# Altium schematic sheet USB_Hub.SchDoc (part 1 of 3)
size A3
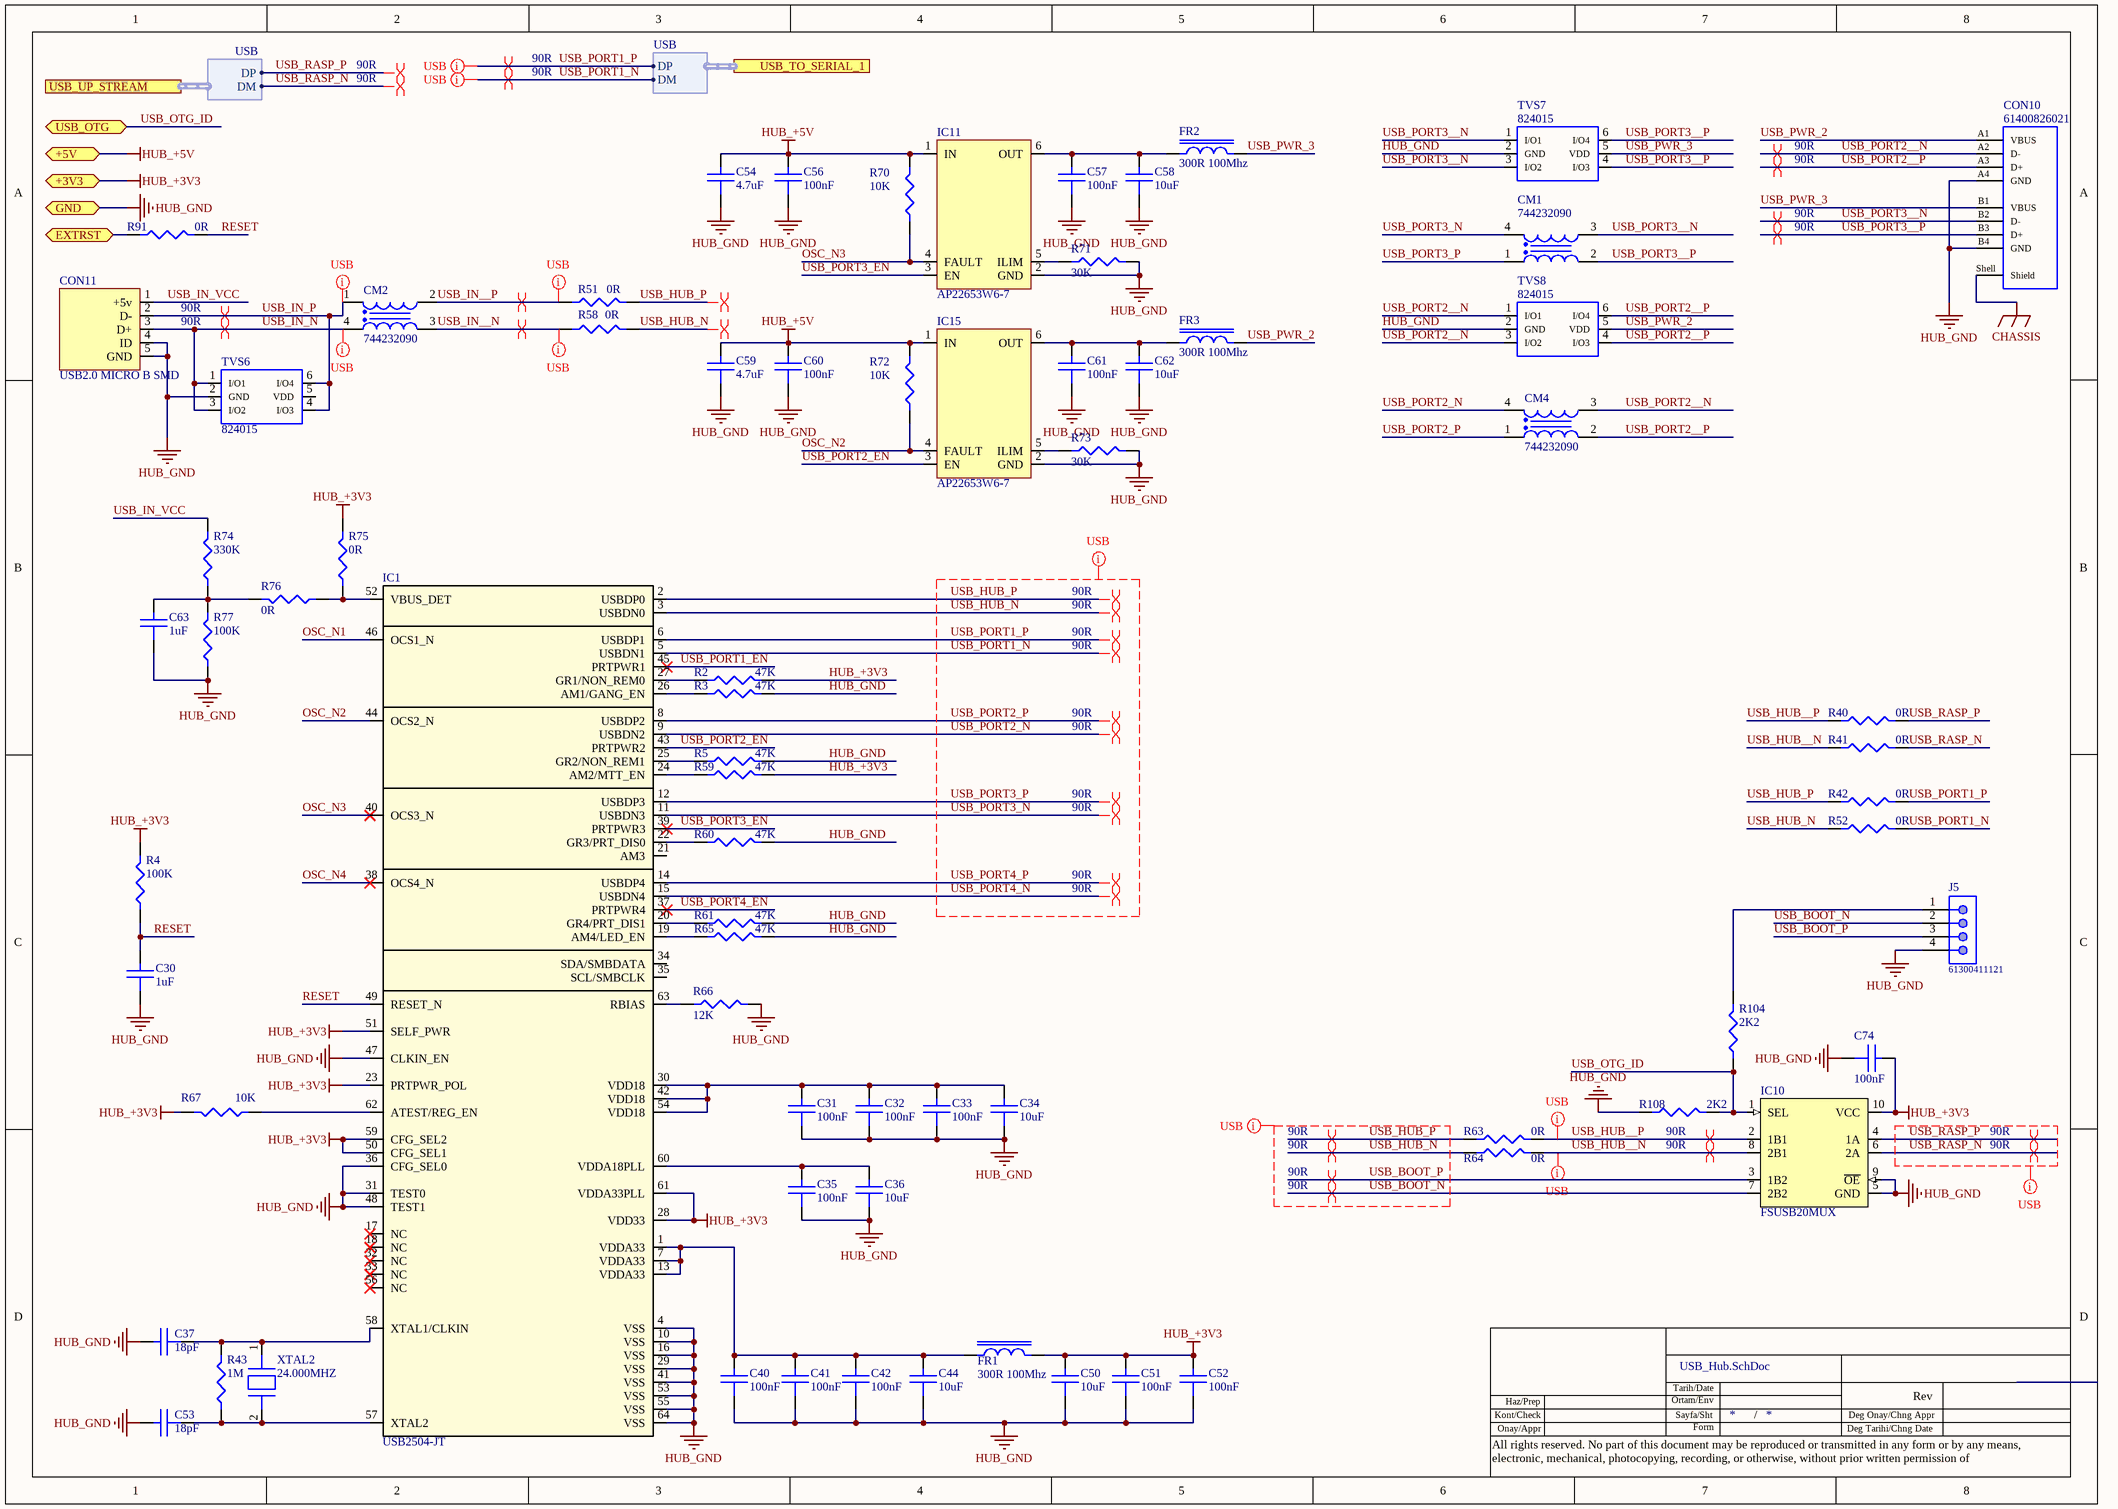
[diagram p0: USB_Hub.SchDoc]

## Parts
C30  1uF  [C0603]
C31  100nF  [C0603]
C32  100nF  [C0603]
C33  100nF  [C0603]
C34  10uF  [C0603]
C35  100nF  [C0603]
C36  10uF  [C0603]
C37  18pF  [C0603]
C40  100nF  [C0603]
C41  100nF  [C0603]
C42  100nF  [C0603]
C44  10uF  [C0603]
C50  10uF  [C0603]
C51  100nF  [C0603]
C52  100nF  [C0603]
C53  18pF  [C0603]
C54  4.7uF  [C0603]
C56  100nF  [C0603]
C57  100nF  [C0603]
C58  10uF  [C0603]
C59  4.7uF  [C0603]
C60  100nF  [C0603]
C61  100nF  [C0603]
C62  10uF  [C0603]
C63  1uF  [C0603]
C74  100nF  [C0603]
CM1  744232090  [WE-CNSW_1206]
CM2  744232090  [WE-CNSW_1206]
CM4  744232090  [WE-CNSW_1206]
CON10  61400826021  [61400826021]
CON11  USB2.0 MICRO B SMD  [USB CON B FEMALE]
FR1  300R 100Mhz  [WE-CBF_0603_High Current]
FR2  300R 100Mhz  [WE-CBF_0603_High Current]
FR3  300R 100Mhz  [WE-CBF_0603_High Current]
IC1  USB2504-JT  [TQFP64]
IC10  FSUSB20MUX  [MSOP-10N]
IC11  AP22653W6-7  [SOT23-6]
IC15  AP22653W6-7  [SOT23-6]
J5  61300411121  [61300411121]
R2  47K  [R0603]
R3  47K  [R0603]
R4  100K  [R0603]
R5  47K  [R0603]
R40  0R  [R0402]
R41  0R  [R0402]
R42  0R  [R0402]
R43  1M  [R0603]
R51  0R  [R0402]
R52  0R  [R0402]
R58  0R  [R0402]
R59  47K  [R0603]
R60  47K  [R0603]
R61  47K  [R0603]
R63  0R  [R0402]
R64  0R  [R0402]
R65  47K  [R0603]
R66  12K  [R0603]
R67  10K  [R0603]
R70  10K  [R0603]
R71  30K  [R0603]
R72  10K  [R0603]
R73  30K  [R0603]
R74  330K  [R0603]
R75  0R  [R0603]
R76  0R  [R0603]
R77  100K  [R0603]
R91  0R  [R0603]
R104  2K2  [R0603]
R108  2K2  [R0603]
TVS6  824015  [SOT-23-6]
TVS7  824015  [SOT-23-6]
TVS8  824015  [SOT-23-6]
XTAL2  24.000MHZ  [CrystalSMD]

## Ports
+3V3 (bidir), +5V (bidir), EXTRST (bidir), GND (bidir), USB_OTG (bidir), USB_TO_SERIAL_1 (harness USB), USB_UP_STREAM (harness USB)

## Harnesses
USB: DP, DM

## Nets
CHASSIS: CON10.Shell(Shield)
HUB_+3V3: C50.1 C51.1 C52.1 C74.1 FR1.2 IC1.23(PRTPWR_POL) IC1.28(VDD33) IC1.50(CFG_SEL1) IC1.51(SELF_PWR) IC1.59(CFG_SEL2) IC1.61(VDDA33PLL) IC10.10(VCC) R2.2 R4.2 R59.2 R67.2 R75.2 ; port +3V3
HUB_+5V: C54.1 C56.1 C59.1 C60.1 IC11.1(IN) IC15.1(IN) R70.2 R72.2 ; port +5V
HUB_GND: C30.2 C31.2 C32.2 C33.2 C34.2 C35.2 C36.2 C37.1 C40.2 C41.2 C42.2 C44.2 C50.2 C51.2 C52.2 C53.1 C54.2 C56.2 C57.2 C58.2 C59.2 C60.2 C61.2 C62.2 C63.2 C74.2 CON10.A4(GND) CON10.B4(GND) CON11.4(ID) CON11.5(GND) IC1.4(VSS) IC1.10(VSS) IC1.16(VSS) IC1.29(VSS) IC1.31(TEST0) IC1.36(CFG_SEL0) IC1.41(VSS) IC1.47(CLKIN_EN) IC1.48(TEST1) IC1.53(VSS) IC1.55(VSS) IC1.64(VSS) IC10.5(GND) IC10.9(~{OE}) IC11.2(GND) IC15.2(GND) J5.4 R3.2 R5.2 R60.2 R61.2 R65.2 R66.2 R71.2 R73.2 R77.1 R108.1 TVS6.2(GND) TVS7.2(GND) TVS8.2(GND) ; port GND
EXTRST: R91.1 ; port EXTRST
OSC_N1: IC1.46(OCS1_N)
OSC_N2: IC1.44(OCS2_N) IC15.4(FAULT) R72.1
OSC_N3: IC1.40(OCS3_N) IC11.4(FAULT) R70.1
OSC_N4: IC1.38(OCS4_N)
RESET: C30.1 IC1.49(RESET_N) R4.1 R91.2
USB_BOOT_N: IC10.7(2B2) J5.2
USB_BOOT_P: IC10.3(1B2) J5.3
USB_HUB__N: IC10.8(2B1) R41.1 R64.2
USB_HUB__P: IC10.2(1B1) R40.1 R63.2
USB_HUB_N: IC1.3(USBDN0) R52.1 R58.2 R64.1
USB_HUB_P: IC1.2(USBDP0) R42.1 R51.2 R63.1
USB_IN__N: CM2.3 R58.1
USB_IN__P: CM2.2 R51.1
USB_IN_N: CM2.4 CON11.3(D+) TVS6.1(I/O1) TVS6.3(I/O2)
USB_IN_P: CM2.1 CON11.2(D-) TVS6.4(I/O3) TVS6.6(I/O4)
USB_IN_VCC: CON11.1(+5v) R74.2
USB_OTG_ID: IC10.1(SEL) R104.1 R108.2 ; port USB_OTG
USB_PORT1_EN: IC1.45(PRTPWR1)
USB_PORT1_N: IC1.5(USBDN1) R52.2 ; port USB_TO_SERIAL_1.DM
USB_PORT1_P: IC1.6(USBDP1) R42.2 ; port USB_TO_SERIAL_1.DP
USB_PORT2__N: CM4.3 CON10.A2(D-) TVS8.1(I/O1) TVS8.3(I/O2)
USB_PORT2__P: CM4.2 CON10.A3(D+) TVS8.4(I/O3) TVS8.6(I/O4)
USB_PORT2_EN: IC1.43(PRTPWR2) IC15.3(EN)
USB_PORT2_N: CM4.4 IC1.9(USBDN2)
USB_PORT2_P: CM4.1 IC1.8(USBDP2)
USB_PORT3__N: CM1.3 CON10.B2(D-) TVS7.1(I/O1) TVS7.3(I/O2)
USB_PORT3__P: CM1.2 CON10.B3(D+) TVS7.4(I/O3) TVS7.6(I/O4)
USB_PORT3_EN: IC1.39(PRTPWR3) IC11.3(EN)
USB_PORT3_N: CM1.4 IC1.11(USBDN3)
USB_PORT3_P: CM1.1 IC1.12(USBDP3)
USB_PORT4_EN: IC1.37(PRTPWR4)
USB_PORT4_N: IC1.15(USBDN4)
USB_PORT4_P: IC1.14(USBDP4)
USB_PWR_2: CON10.A1(VBUS) FR3.2 TVS8.5(VDD)
USB_PWR_3: CON10.B1(VBUS) FR2.2 TVS7.5(VDD)
USB_RASP_N: IC10.6(2A) R41.2 ; port USB_UP_STREAM.DM
USB_RASP_P: IC10.4(1A) R40.2 ; port USB_UP_STREAM.DP
NetC31_1: C31.1 C32.1 C33.1 C34.1 IC1.30(VDD18) IC1.42(VDD18) IC1.54(VDD18)
NetC35_1: C35.1 C36.1 IC1.60(VDDA18PLL)
NetC37_2: C37.2 IC1.58(XTAL1/CLKIN) R43.2 XTAL2.1
NetC40_1: C40.1 C41.1 C42.1 C44.1 FR1.1 IC1.1(VDDA33) IC1.7(VDDA33) IC1.13(VDDA33)
NetC53_2: C53.2 IC1.57(XTAL2) R43.1 XTAL2.2
NetC57_1: C57.1 C58.1 FR2.1 IC11.6(OUT)
NetC61_1: C61.1 C62.1 FR3.1 IC15.6(OUT)
NetC63_1: C63.1 R74.1 R76.2 R77.2
NetIC1_19: IC1.19(AM4/LED_EN) R65.1
NetIC1_20: IC1.20(GR4/PRT_DIS1) R61.1
NetIC1_22: IC1.22(GR3/PRT_DIS0) R60.1
NetIC1_24: IC1.24(AM2/MTT_EN) R59.1
NetIC1_25: IC1.25(GR2/NON_REM1) R5.1
NetIC1_26: IC1.26(AM1/GANG_EN) R3.1
NetIC1_27: IC1.27(GR1/NON_REM0) R2.1
NetIC1_52: IC1.52(VBUS_DET) R75.1 R76.1
NetIC1_62: IC1.62(ATEST/REG_EN) R67.1
NetIC1_63: IC1.63(RBIAS) R66.1
NetIC11_5: IC11.5(ILIM) R71.1
NetIC15_5: IC15.5(ILIM) R73.1
NetJ5_1: J5.1 R104.2

Not connected (* = marked no-connect by the designer): IC1 17(NC)* 18(NC)* 21(AM3) 32(NC)* 33(NC)* 34(SDA/SMBDATA) 35(SCL/SMBCLK) 56(NC)*; TVS6 5(VDD)

## Layout directives
differential pair; differential pair class 90R: USB_BOOT_N, USB_BOOT_P, USB_HUB__N, USB_HUB__P, USB_HUB_N, USB_HUB_P, USB_IN__N, USB_IN__P, USB_IN_N, USB_IN_P, USB_PORT1_N, USB_PORT1_P, USB_PORT2__N, USB_PORT2__P, USB_PORT2_N, USB_PORT2_P, USB_PORT3__N, USB_PORT3__P, USB_PORT3_N, USB_PORT3_P, USB_PORT4_N, USB_PORT4_P, USB_RASP_N, USB_RASP_P
net class USB: USB_BOOT_N, USB_BOOT_P, USB_HUB__N, USB_HUB__P, USB_HUB_N, USB_HUB_P, USB_IN__N, USB_IN__P, USB_IN_N, USB_IN_P, USB_PORT1_N, USB_PORT1_P, USB_PORT2_N, USB_PORT2_P, USB_PORT3_N, USB_PORT3_P, USB_PORT4_N, USB_PORT4_P, USB_RASP_N, USB_RASP_P

## Notes on the sheet
- Tarih/Date
- Kont/Check
- Onay/Appr
- Haz/Prep
- Ortam/Env
- Sayfa/Sht
- Form
- /
- Deg Tarihi/Chng Date
- Deg Onay/Chng Appr
- Rev
- All rights reserved. No part of this document may be reproduced or transmitted in any form or by any means, electronic, mechanical, photocopying, recording, or otherwise, without prior written permission of